# Altium project motherboard.PrjPcb
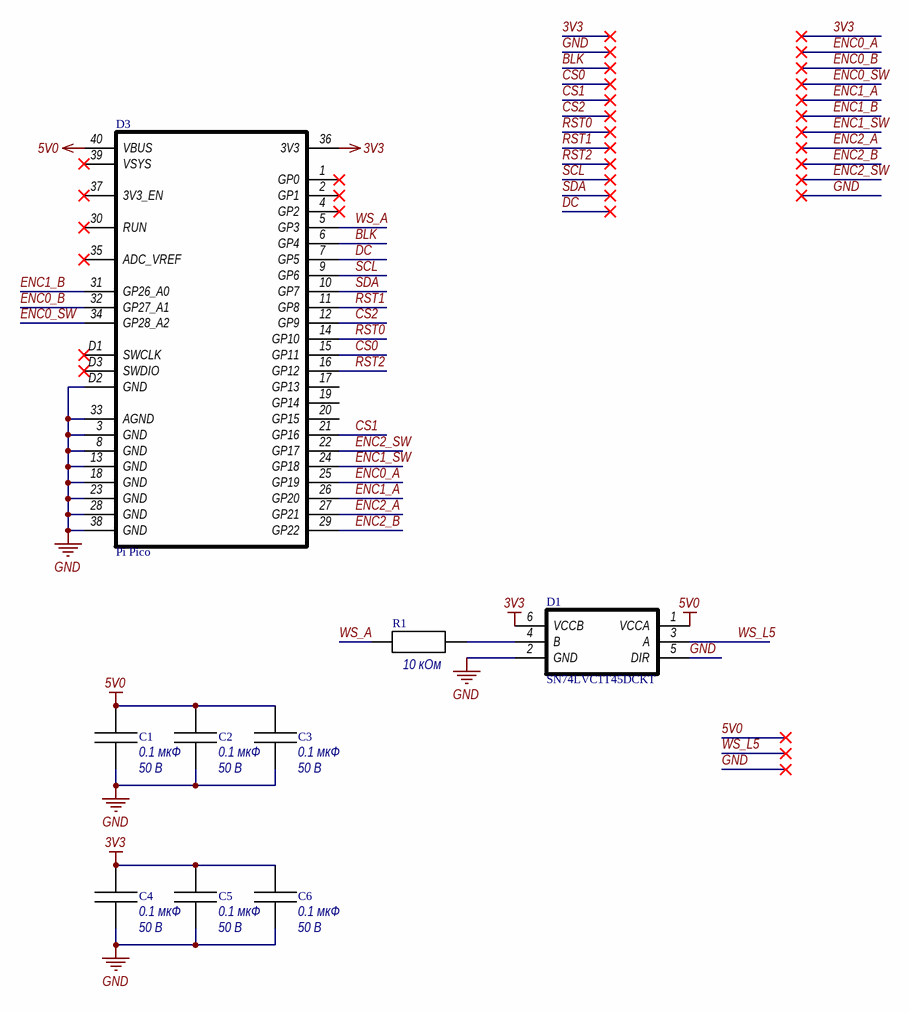
[diagram p0: motherboard.SchDoc]
1 sheet, 9 parts. Net scope: global (net labels, ports and power ports of the same name join across sheets).
Board file: motherboard.PcbDoc

## Sheet motherboard.SchDoc
size 209 x 297 mm; DocumentCode: Децимальный номер; SchemeType: Схема электрическая принципиальная; TitleLine1: Название проекта (строка 1); TitleLine2: Название проекта (строка 2); PageSetup: Record=PageOptionsZCenterHorizontal=TrueZCenterVertical=TrueZPrintScale=0.95ZXCorrection=1.00ZYCorrection=1.00ZPrintKind=2ZBorderSize=5000000ZLeftOffset=0ZBottomOffset=0ZOrientation=1ZPaperLength=1000ZPaperWidth=1000ZScale=100ZPaperSource=7ZPrintQuality=600ZMediaType=1ZDitherType=10ZPaperKind=A4 (210 x 297 мм)ZPrintScaleMode=1

### Parts
C1  value 0.1 мкФ  Voltage: 50 В  [0805-CAP]  (hidden comment: GRM21BR71H104K)
C2  value 0.1 мкФ  Voltage: 50 В  [0805-CAP]  (hidden comment: GRM21BR71H104K)
C3  value 0.1 мкФ  Voltage: 50 В  [0805-CAP]  (hidden comment: GRM21BR71H104K)
C4  value 0.1 мкФ  Voltage: 50 В  [0805-CAP]  (hidden comment: GRM21BR71H104K)
C5  value 0.1 мкФ  Voltage: 50 В  [0805-CAP]  (hidden comment: GRM21BR71H104K)
C6  value 0.1 мкФ  Voltage: 50 В  [0805-CAP]  (hidden comment: GRM21BR71H104K)
D1  SN74LVC1T45DCKT  [sc70-6]
D3  Pi Pico  [Pi Pico]
R1  value 10 кОм  [0805-RES]  (hidden comment: RC0805FR-0710KL)

### Nets
3V3: C4.2 C5.2 C6.2 D1.6(VCCB) D3.36(3V3)
5V0: C1.2 C2.2 C3.2 D1.1(VCCA) D3.40(VBUS)
GND: C1.1 C2.1 C3.1 C4.1 C5.1 C6.1 D1.2(GND) D1.5(DIR) D3.3(GND) D3.8(GND) D3.13(GND) D3.18(GND) D3.23(GND) D3.28(GND) D3.33(AGND) D3.38(GND) D3.D2(GND)
BLK: D3.6(GP4)
CS0: D3.15(GP11)
CS1: D3.21(GP16)
CS2: D3.12(GP9)
DC: D3.7(GP5)
ENC0_A: D3.25(GP19)
ENC0_B: D3.32(GP27_A1)
ENC0_SW: D3.34(GP28_A2)
ENC1_A: D3.26(GP20)
ENC1_B: D3.31(GP26_A0)
ENC1_SW: D3.24(GP18)
ENC2_A: D3.27(GP21)
ENC2_B: D3.29(GP22)
ENC2_SW: D3.22(GP17)
RST0: D3.14(GP10)
RST1: D3.11(GP8)
RST2: D3.16(GP12)
SCL: D3.9(GP6)
SDA: D3.10(GP7)
WS_A: D3.5(GP3) R1.1
WS_L5: D1.3(A)
NetD1_4: D1.4(B) R1.2

Not connected (* = marked no-connect by the designer): D3 1(GP0)* 2(GP1)* 4(GP2)* 17(GP13) 19(GP14) 20(GP15) 30(RUN)* 35(ADC_VREF)* 37(3V3_EN)* 39(VSYS)* D1(SWCLK)* D3(SWDIO)*

### Notes on the sheet
- Перв. примен.
- Справ. №
- Подп. и дата
- Инв. № дубл.
- Взам. инв. №
- Разраб.
- Изм.
- Лист
- № докум.
- Подп.
- Дата
- Лит.
- Масса
- Масштаб
- Пров.
- Т. контр.
- Листов
- Н. контр.
- Утв.
- Нач. лаб.
- Инв. № подл.
- Копировал
- Формат А4

### Library data of the parts
C1-C6 = CMP-0544-A.1: Конденсатор керамический, 0.1 мкФ, X7R, 50 В, точность 10%, 0805; Accuracy: 10%
D1 = CMP-0607-A.1: Преобразователь логических уровней с входом направления, 1.65 - 5.5 В; Manufacturer: Texas Instruments; Temperature: -40 - 85°C
D3 = CMP-0736-A.1: Отладочная плата микроконтроллера RP2040, 1.62 - 3.63 В; Manufacturer: Raspberry Pi; Temperature: -20 - 85°C
R1 = CMP-0677-A.2: Резистор, 10 кОм, 0.125 Вт, точность 1%, 0805; Accuracy: 1%